# EAGLE schematic working (EAGLE 8.2.2)
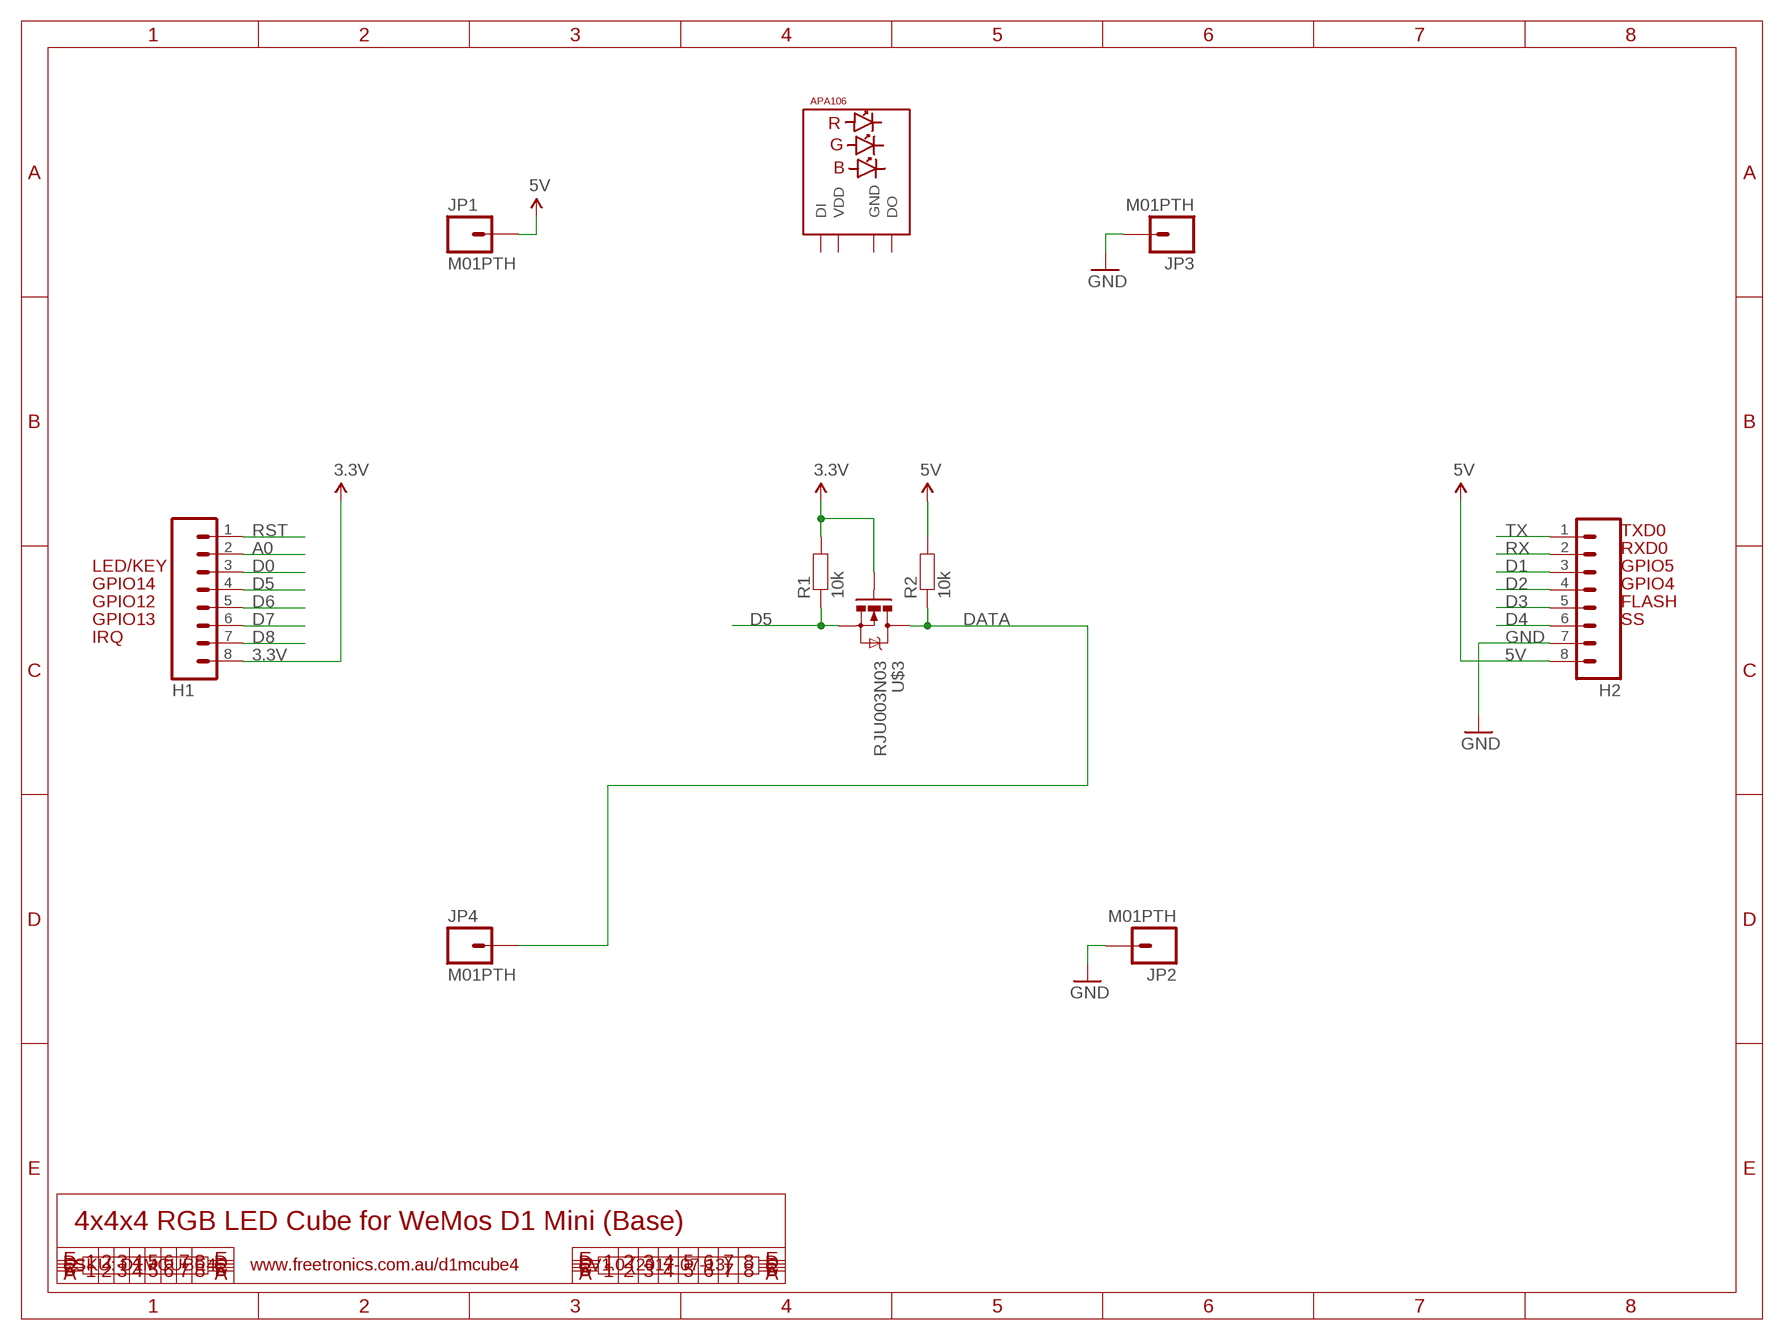
[diagram p0: schematic, sheet 1]

## Parts
H1  M08  [1X08]
H2  M08  [1X08]
JP1  M01PTH  [1X01]
JP2  M01PTH  [1X01]
JP3  M01PTH  [1X01]
JP4  M01PTH  [1X01]
R1  10k  RESISTOR0603  [0603]
R2  10k  RESISTOR0603  [0603]
U$2  APA106F8  [LED8MMRGB]
U$3  RJU003N03  MOSFET-NSOT-323  [SOT32-3]

## Nets
3.3V: H1.8 R1.2 U$3.1(G)
5V: H2.8 JP1.1 R2.2
A0: H1.2
D0: H1.3
D1: H2.3
D2: H2.4
D3: H2.5
D4: H2.6
D5: H1.4 R1.1 U$3.2(S)
D6: H1.5
D7: H1.6
D8: H1.7
DATA: JP4.1 R2.1 U$3.3(D)
GND: H2.7 JP2.1 JP3.1
RST: H1.1
RX: H2.2
TX: H2.1
Unconnected: U$2.1(DO) U$2.4(DI)

## Notes on the sheet
- TXD0
- RXD0
- LED/KEY | GPIO5
- GPIO14 | GPIO4
- GPIO12 | FLASH
- GPIO13 | SS
- IRQ
- 4x4x4 RGB LED Cube for WeMos D1 Mini (Base)
- SKU: D1MCUBE4 | www.freetronics.com.au/d1mcube4 | V1.0 (2017-07-13)

## Power pins joined to a net without a drawn wire
GND: U$2.2(GND)
VDD: U$2.3(VDD)

## Library data of the parts
H1 H2 = freetronics-original:M08: Header 8 Standard 8-pin 0.1" header. Use with straight break away headers (SKU : PRT-00116), right angle break away headers (PRT-00553), swiss pins (PRT-00743), machine pins (PRT-00117), and female headers (PRT-00115).
JP1-JP4 = freetronics-master-v1.1:M01: Header 1 Standard 1-pin 0.1" header. Use with straight break away headers (SKU : PRT-00116), right angle break away headers (PRT-00553), swiss pins (PRT-00743), machine pins (PRT-00117), and female headers (PRT-00115).
R1 R2 = freetronics-jon:RESISTOR: Resistor Basic schematic elements and footprints for 0603, 1206, and PTH 1/10th watt (small) resistors.
U$2 = freetronics-jon:APA106
U$3 = freetronics-jon:MOSFET-N: Basic N-Channel MOSFET

## Net classes
0 default: width 0.203 mm, drill 0.356 mm, clearance 0.152 mm
1 power: width 0.203 mm, clearance 0.152 mm